# EAGLE design placa_nano (EAGLE 7.7.0)
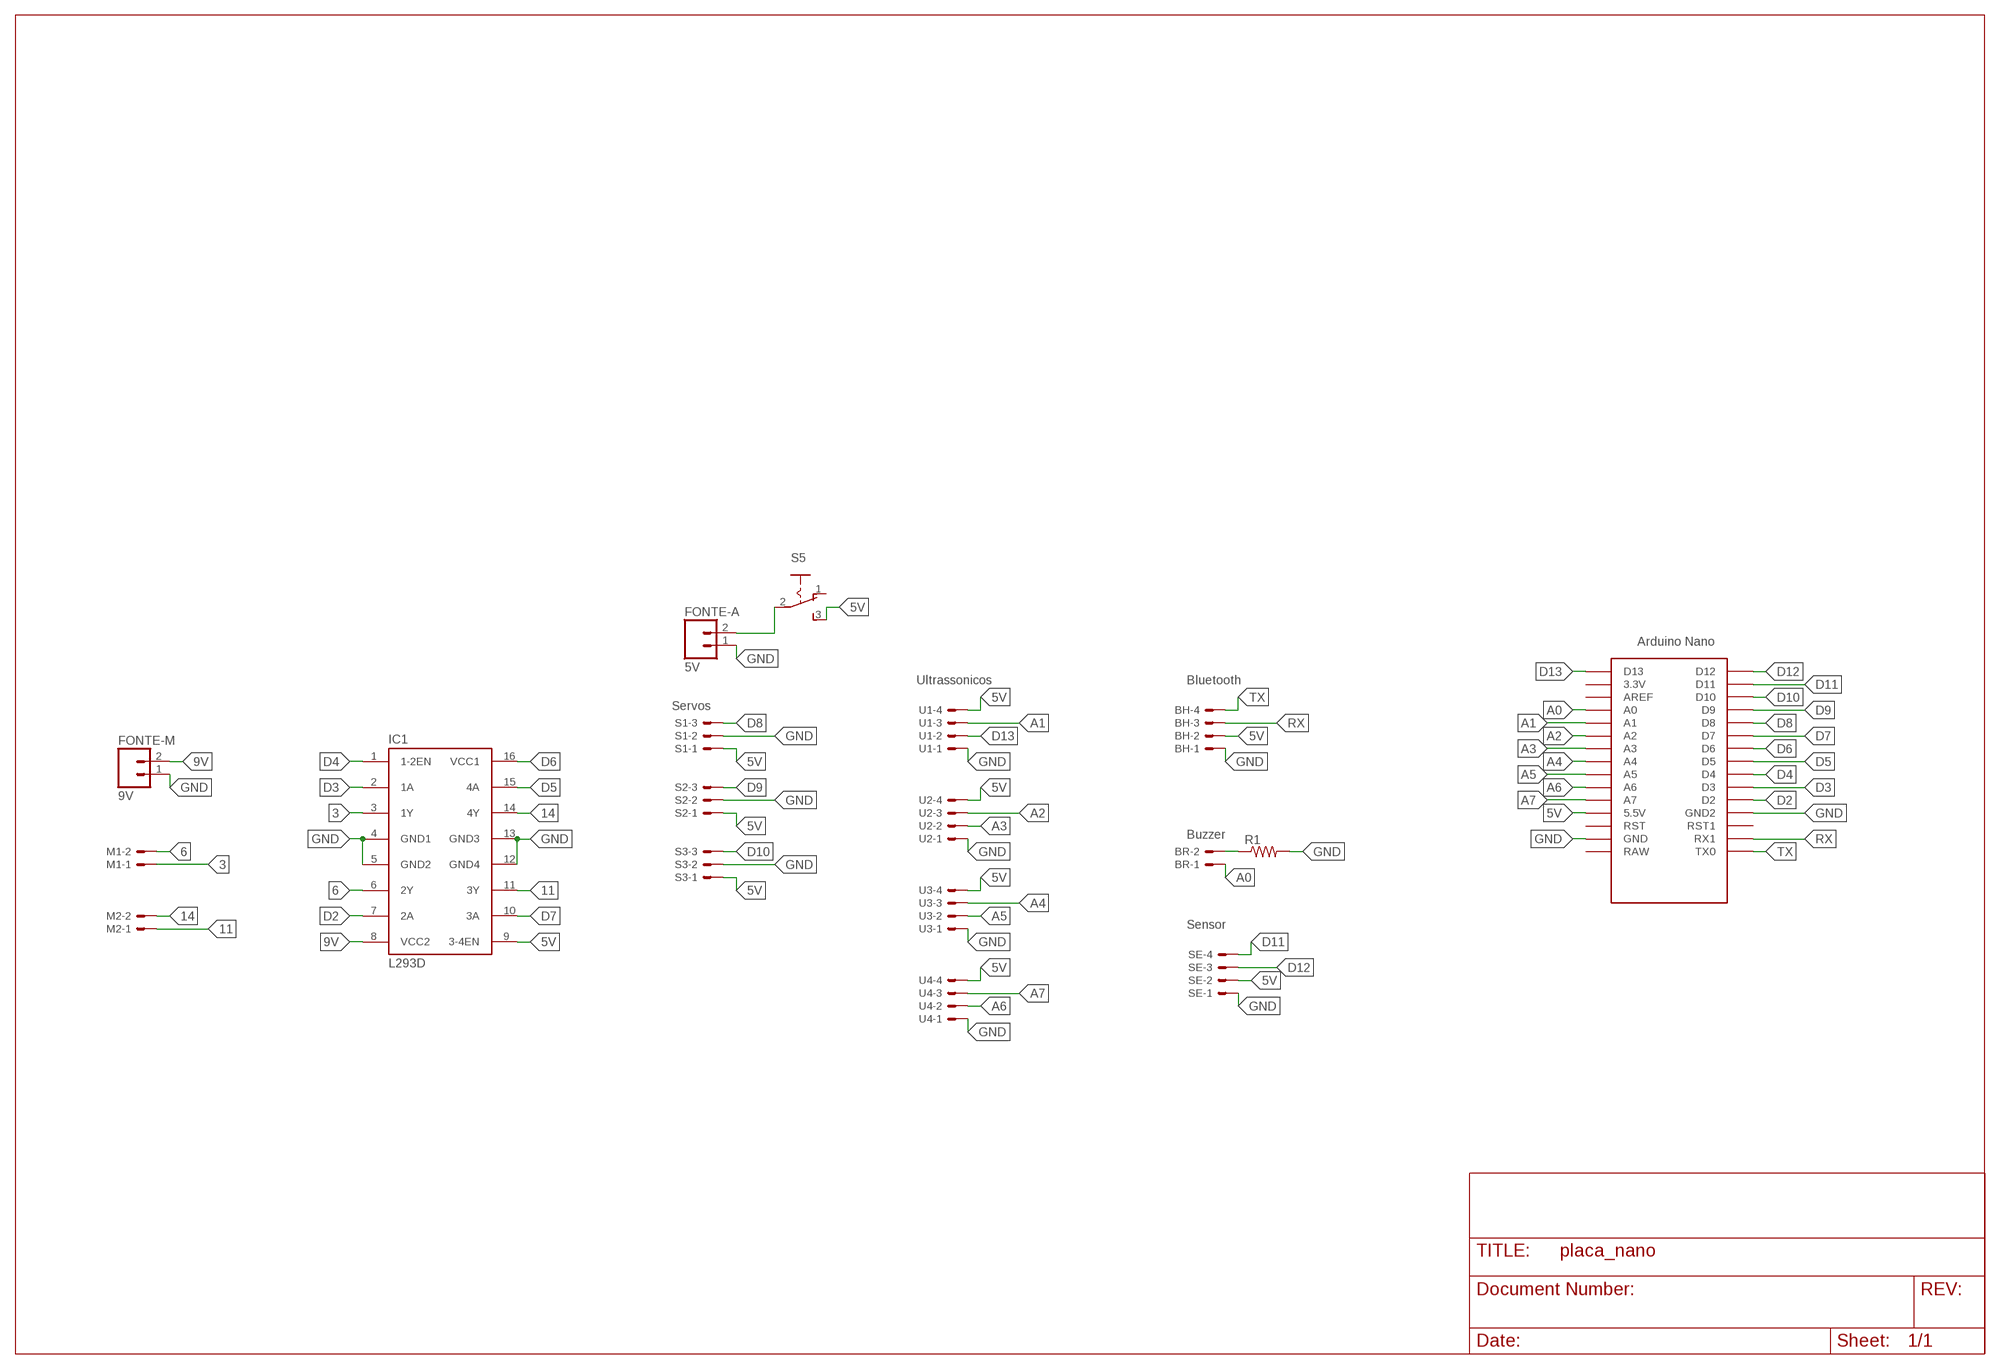
[diagram p0: schematic, sheet 1]

## Parts
BH  22-23-2041  [22-23-2041]
BR  22-23-2021  [22-23-2021]
FONTE-A  5V  M02  [02P]
FONTE-M  9V  M02  [02P]
IC1  L293D  [DIL16]
M1  22-23-2021  [22-23-2021]
M2  22-23-2021  [22-23-2021]
R1  R-US_0207/10  [0207/10]
S1  22-23-2031  [22-23-2031]
S2  22-23-2031  [22-23-2031]
S3  22-23-2031  [22-23-2031]
S5  255SB  [255SB]
SE  22-23-2041  [22-23-2041]
U1  22-23-2041  [22-23-2041]
U2  22-23-2041  [22-23-2041]
U3  22-23-2041  [22-23-2041]
U4  22-23-2041  [22-23-2041]
U$1  NANO  [NANO]

## Nets
3: IC1.3(1Y) M1.1
5V: BH.2 FONTE-A.2 IC1.9(3-4EN) S1.1 S2.1 S3.1 S5.2(P) S5.3(S) SE.2 U1.4 U2.4 U3.4 U4.4 U$1.5V(5.5V)
6: IC1.6(2Y) M1.2
9V: FONTE-M.2 IC1.8(VCC2)
11: IC1.11(3Y) M2.1
14: IC1.14(4Y) M2.2
A0: BR.1 U$1.A0
A1: U1.3 U$1.A1
A2: U2.3 U$1.A2
A3: U2.2 U$1.A3
A4: U3.3 U$1.A4
A5: U3.2 U$1.A5
A6: U4.2 U$1.A6
A7: U4.3 U$1.A7
D2: IC1.7(2A) U$1.D2
D3: IC1.2(1A) U$1.D3
D4: IC1.1(1-2EN) U$1.D4
D5: IC1.15(4A) U$1.D5
D6: IC1.16(VCC1) U$1.D6
D7: IC1.10(3A) U$1.D7
D8: S1.3 U$1.D8
D9: S2.3 U$1.D9
D10: S3.3 U$1.D10
D11: SE.4 U$1.D11
D12: SE.3 U$1.D12
D13: U1.2 U$1.D13
GND: BH.1 FONTE-A.1 FONTE-M.1 IC1.4(GND1) IC1.5(GND2) IC1.12(GND4) IC1.13(GND3) R1.2 S1.2 S2.2 S3.2 SE.1 U1.1 U2.1 U3.1 U4.1 U$1.GND U$1.GND1(GND2)
N$4: BR.2 R1.1
RX: BH.3 U$1.RX1
TX: BH.4 U$1.TX0
Unconnected: S5.1(O) U$1.3.3V U$1.AREF U$1.RAW U$1.RST U$1.RST1

## Notes on the sheet
- Ultrassonicos | Bluetooth
- Servos
- Buzzer
- Sensor

## Library data of the parts
BH SE U1-U4 = con-molex:22-23-2041: .100" (2.54mm) Center Header - 4 Pin; MF: MOLEX; MPN: 22-23-2041; OC_FARNELL: 1462920; OC_NEWARK: 38C0355
BR M1 M2 = con-molex:22-23-2021: .100" (2.54mm) Center Header - 2 Pin; MF: MOLEX; MPN: 22-23-2021; OC_FARNELL: 1462926; OC_NEWARK: 25C3832
FONTE-A FONTE-M = con-amp-quick:M02: AMP QUICK CONNECTOR; OC_FARNELL: unknown; OC_NEWARK: unknown
IC1 = st-microelectronics:L293D: PUSH-PULL 4 CHANNEL DRIVER; MPN: L293D; OC_FARNELL: 9589619; OC_NEWARK: 56P8249
R1 = resistor:R-US_: RESISTOR, American symbol
S1-S3 = con-molex:22-23-2031: .100" (2.54mm) Center Header - 3 Pin; MF: MOLEX; MPN: 22-23-2031; OC_FARNELL: 1462950; OC_NEWARK: 30C0862
S5 = switch:255SB: SLIDING SWITCH Distributor Buerklin, 11G810
U$1 = Arduino-clone:NANO: Arduino Nano

## Board
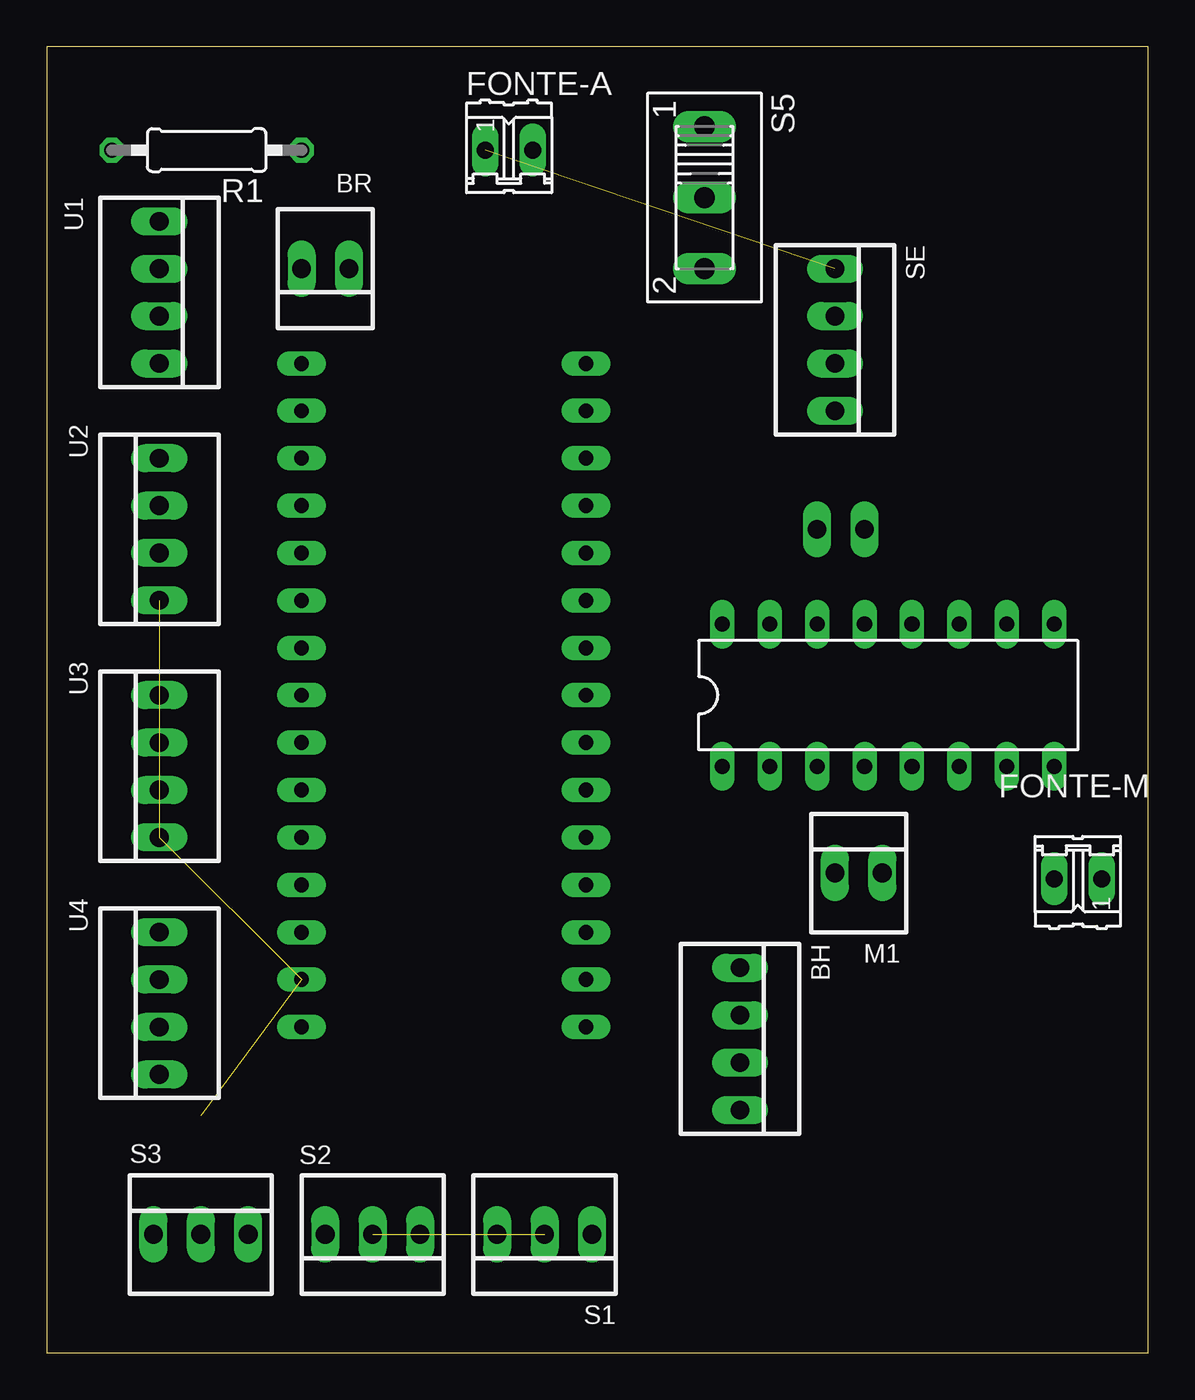
[diagram p1: board, top side]
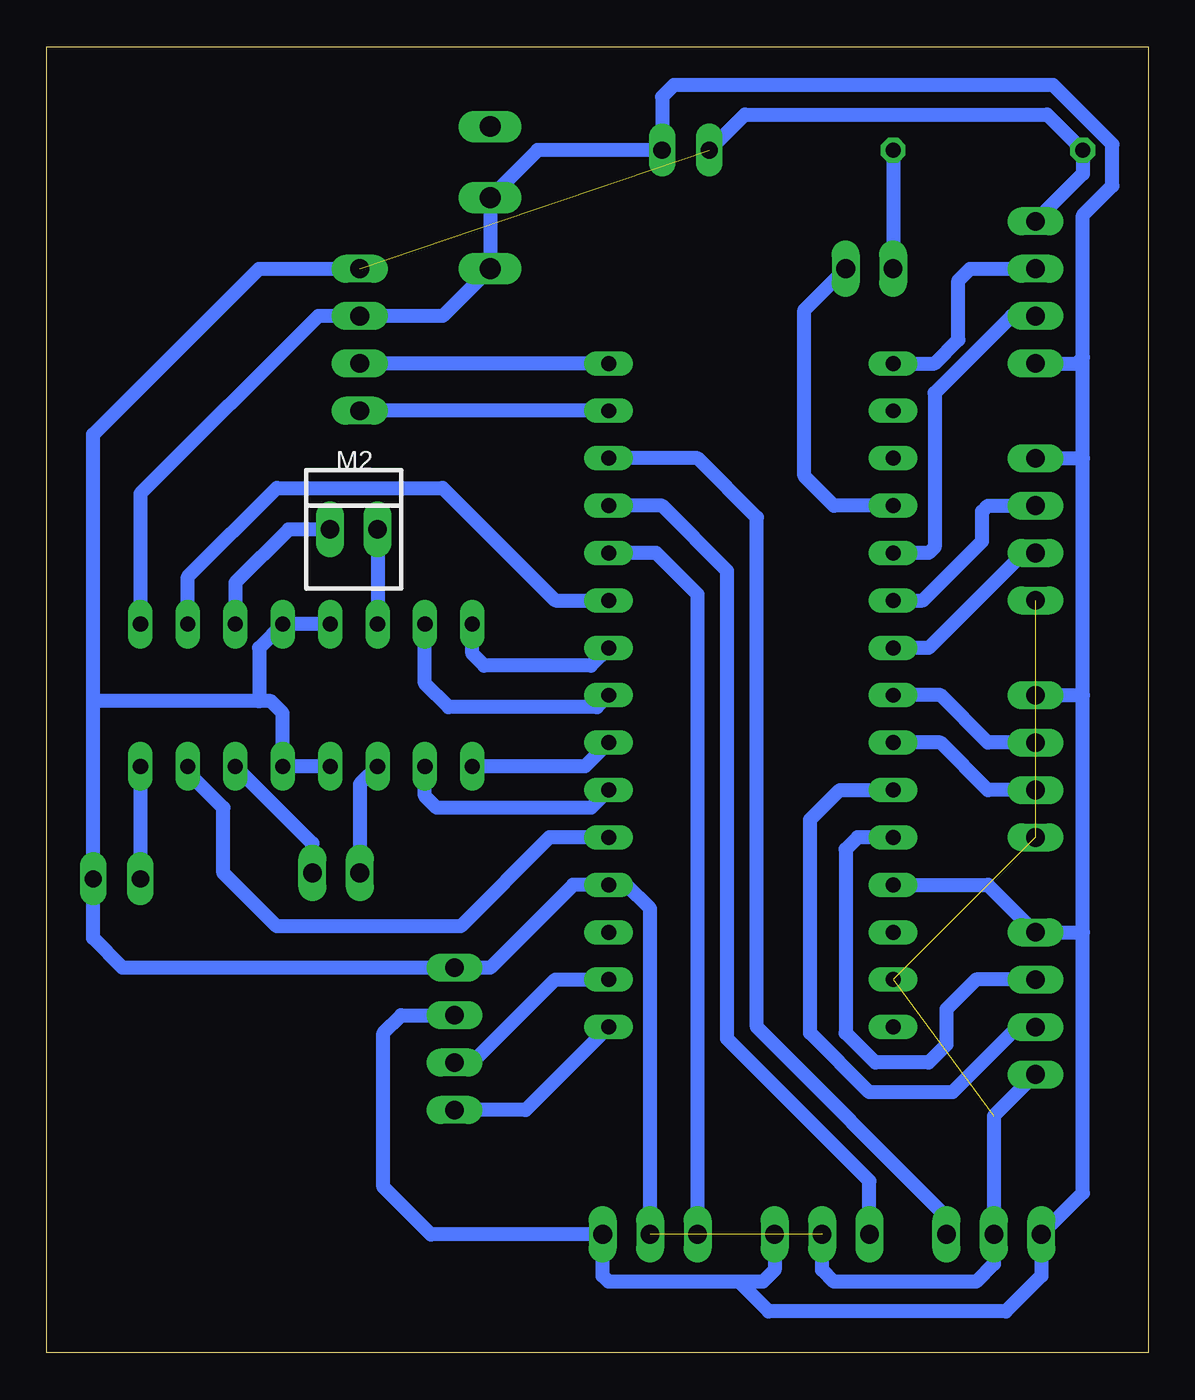
[diagram p2: board, bottom side, seen from below]

Size 59 x 70 mm. Coordinates in mm from the lower left corner, seen from the top.
Outline: 0,0 59,0 59,70 0,70 0,0
Copper layers (1*16): Top 0.035mm / dielectric 1.5mm / Bottom 0.035mm
Design rules "default": minimum track width 10mil, minimum drill 24mil, track to track 8mil, track to pad 8mil, pad to pad 8mil, via to via 8mil, smd to smd 8mil, copper to edge 40mil, drill to drill 8mil, minimum pad ring 10mil, minimum via ring 8mil, stop-mask expansion 4mil, vias tented up to drill 0mil, thermal gap 10mil

### Footprints (pad centres in the part's own frame; a part is rotated, then mirrored left to right if it is on the bottom)
22-23-2041 = drill 1 long: 1 -3.81,0; 2 -1.27,0; 3 1.27,0; 4 3.81,0
22-23-2021 = drill 1 long: 1 -1.27,0; 2 1.27,0
02P = drill 0.914 long: 1 -1.27,0; 2 1.27,0
DIL16 = drill 0.813 long: 1 -8.89,-3.81; 2 -6.35,-3.81; 3 -3.81,-3.81; 4 -1.27,-3.81; 5 1.27,-3.81; 6 3.81,-3.81; 7 6.35,-3.81; 8 8.89,-3.81; 9 8.89,3.81; 10 6.35,3.81; 11 3.81,3.81; 12 1.27,3.81; 13 -1.27,3.81; 14 -3.81,3.81; 15 -6.35,3.81; 16 -8.89,3.81
0207/10 = drill 0.813 octagon: 1 -5.08,0; 2 5.08,0
22-23-2031 = drill 1 long: 1 -2.54,0; 2 0,0; 3 2.54,0
255SB = drill 1.118 long: 1 -3.81,0; 2 0,0; 3 3.81,0
NANO = drill 0.8 long: 3.3V -10.16,24.13; 5V -10.16,-1.27; A0 -10.16,19.05; A1 -10.16,16.51; A2 -10.16,13.97; A3 -10.16,11.43; A4 -10.16,8.89; A5 -10.16,6.35; A6 -10.16,3.81; A7 -10.16,1.27; AREF -10.16,21.59; D2 5.08,1.27; D3 5.08,3.81; D4 5.08,6.35; D5 5.08,8.89; D6 5.08,11.43; D7 5.08,13.97; D8 5.08,16.51; D9 5.08,19.05; D10 5.08,21.59; D11 5.08,24.13; D12 5.08,26.67; D13 -10.16,26.67; GND -10.16,-6.35; GND1 5.08,-1.27; RAW -10.16,-8.89; RST -10.16,-3.81; RST1 5.08,-3.81; RX1 5.08,-6.35; TX0 5.08,-8.89

### Placement (x,y rotation side)
BH  37.15,16.83 270 top
BR  14.92,58.1 180 top
FONTE-A  24.77,64.45 0 top
FONTE-M  55.24,25.4 180 top
IC1  45.09,35.24 0 top
M1  43.5,25.72 0 top
M2  42.55,44.13 0 bottom
R1  8.57,64.45 180 top
S1  26.67,6.35 180 top
S2  17.46,6.35 180 top
S3  8.26,6.35 0 top
S5  35.24,61.91 270 top
SE  42.23,54.29 270 top
U1  6.03,56.83 270 top
U2  6.03,44.13 90 top
U3  6.03,31.43 90 top
U4  6.03,18.73 90 top
U$1  23.81,26.35 0 top

### Tracks (layer width: path | path; a pad name or v marks a point on that pad's centre or on a via)
3
  Bottom 0.762: IC1.3 42.23,30.48 M1.1
5V
  Bottom 0.762: BH.2 40.01,18.1 40.96,17.14 40.96,8.89 38.42,6.35 S1.1 29.21,4.13 28.89,3.81 21.91,3.81 | S2.1 20,4.45 20.64,3.81 21.91,3.81 | 21.91,3.81 20.32,2.22 7.62,2.22 5.71,4.13 S3.1 3.49,8.57 3.49,22.54 | 3.49,22.54 3.49,35.24 | 3.49,35.24 3.49,47.94 | U2.4 3.49,47.94 | U3.4 3.49,35.24 | 3.49,22.54 U4.4 8.57,25.08 U$1.5V | IC1.9 53.98,46.04 44.45,55.56 SE.2 37.78,55.56 S5.3 S5.2 32.7,64.45 FONTE-A.2 26.04,67.31 25.4,67.94 5.08,67.94 1.91,64.77 1.91,62.55 3.49,60.96 3.49,53.34 | 3.49,47.94 3.49,53.34 | U1.4 3.81,53.02 3.49,53.34
6
  Bottom 0.762: M1.2 44.77,27.3 IC1.6
9V
  Bottom 0.762: IC1.8 FONTE-M.2
11
  Bottom 0.762: M2.1 46.04,44.13 48.9,41.27 IC1.11
14
  Bottom 0.762: M2.2 IC1.14
A0
  Bottom 0.762: U$1.A0 16.83,45.4 18.41,46.99 18.41,55.88 BR.1
A1
  Bottom 0.762: U1.3 7.3,55.56 11.43,51.44 11.43,43.18 11.75,42.86 U$1.A1
A2
  Bottom 0.762: U$1.A2 12.06,40.32 8.89,43.5 8.89,45.09 8.57,45.4 U2.3
A3
  Bottom 0.762: U2.2 6.67,42.86 11.75,37.78 U$1.A3
A4
  Bottom 0.762: U3.3 8.57,32.7 11.11,35.24 U$1.A4
A5
  Bottom 0.762: U3.2 8.57,30.16 11.11,32.7 U$1.A5
A6
  Bottom 0.762: U4.2 6.99,17.46 10.48,13.97 14.92,13.97 18.1,17.14 18.1,28.57 16.51,30.16 U$1.A6
A7
  Bottom 0.762: U4.3 9.21,20 10.79,18.41 10.79,16.51 11.75,15.56 14.61,15.56 16.19,17.14 16.19,26.99 15.56,27.62 U$1.A7
D2
  Bottom 0.762: IC1.7 51.44,31.11 49.53,29.21 49.53,25.72 46.67,22.86 36.83,22.86 32.07,27.62 U$1.D2
D3
  Bottom 0.762: U$1.D3 29.84,29.21 38.1,29.21 38.73,29.84 IC1.2
D4
  Bottom 0.762: U$1.D4 30.16,31.43 IC1.1
D5
  Bottom 0.762: U$1.D5 29.53,34.61 37.47,34.61 38.73,35.88 IC1.15
D6
  Bottom 0.762: U$1.D6 29.84,36.83 35.56,36.83 36.2,37.47 IC1.16
D7
  Bottom 0.762: IC1.10 51.44,41.59 46.67,46.35 37.78,46.35 31.75,40.32 U$1.D7
D8
  Bottom 0.762: S1.3 24.13,40.64 26.35,42.86 U$1.D8
D9
  Bottom 0.762: S2.3 14.92,9.21 22.54,16.83 22.54,41.91 26.04,45.4 U$1.D9
D10
  Bottom 0.762: S3.3 10.79,7.3 20.95,17.46 20.95,44.77 24.13,47.94 U$1.D10
D11
  Bottom 0.762: U$1.D11 SE.4
D12
  Bottom 0.762: U$1.D12 SE.3
D13
  Bottom 0.762: U$1.D13 11.43,53.02 10.16,54.29 10.16,57.47 9.53,58.1 U1.2
GND  (5 unrouted)
  Bottom 0.762: IC1.13 IC1.12 47.62,37.78 47.62,34.92 | U4.1 8.26,12.7 S3.2 8.26,4.76 9.21,3.81 16.83,3.81 17.46,4.45 S2.2 | S1.2 26.67,23.81 27.94,25.08 U$1.GND1 30.8,25.08 35.24,20.64 BH.1 54.93,20.64 56.52,22.23 FONTE-M.1 56.52,34.92 | U1.1 3.49,63.18 R1.2 5.4,66.36 21.59,66.36 FONTE-A.1 | IC1.4 IC1.5 46.35,34.29 46.99,34.92 47.62,34.92 | 56.52,34.92 56.52,49.21 47.62,58.1 SE.1 | 47.62,34.92 56.52,34.92
N$4
  Bottom 0.762: R1.1 BR.2
RX
  Bottom 0.762: BH.3 36.2,15.56 31.75,20 U$1.RX1
TX
  Bottom 0.762: U$1.TX0 33.34,13.02 BH.4